# EAGLE schematic TIVA_SHIELD_Ver_2.3_AD8032_MSOP (EAGLE 9.6.2)
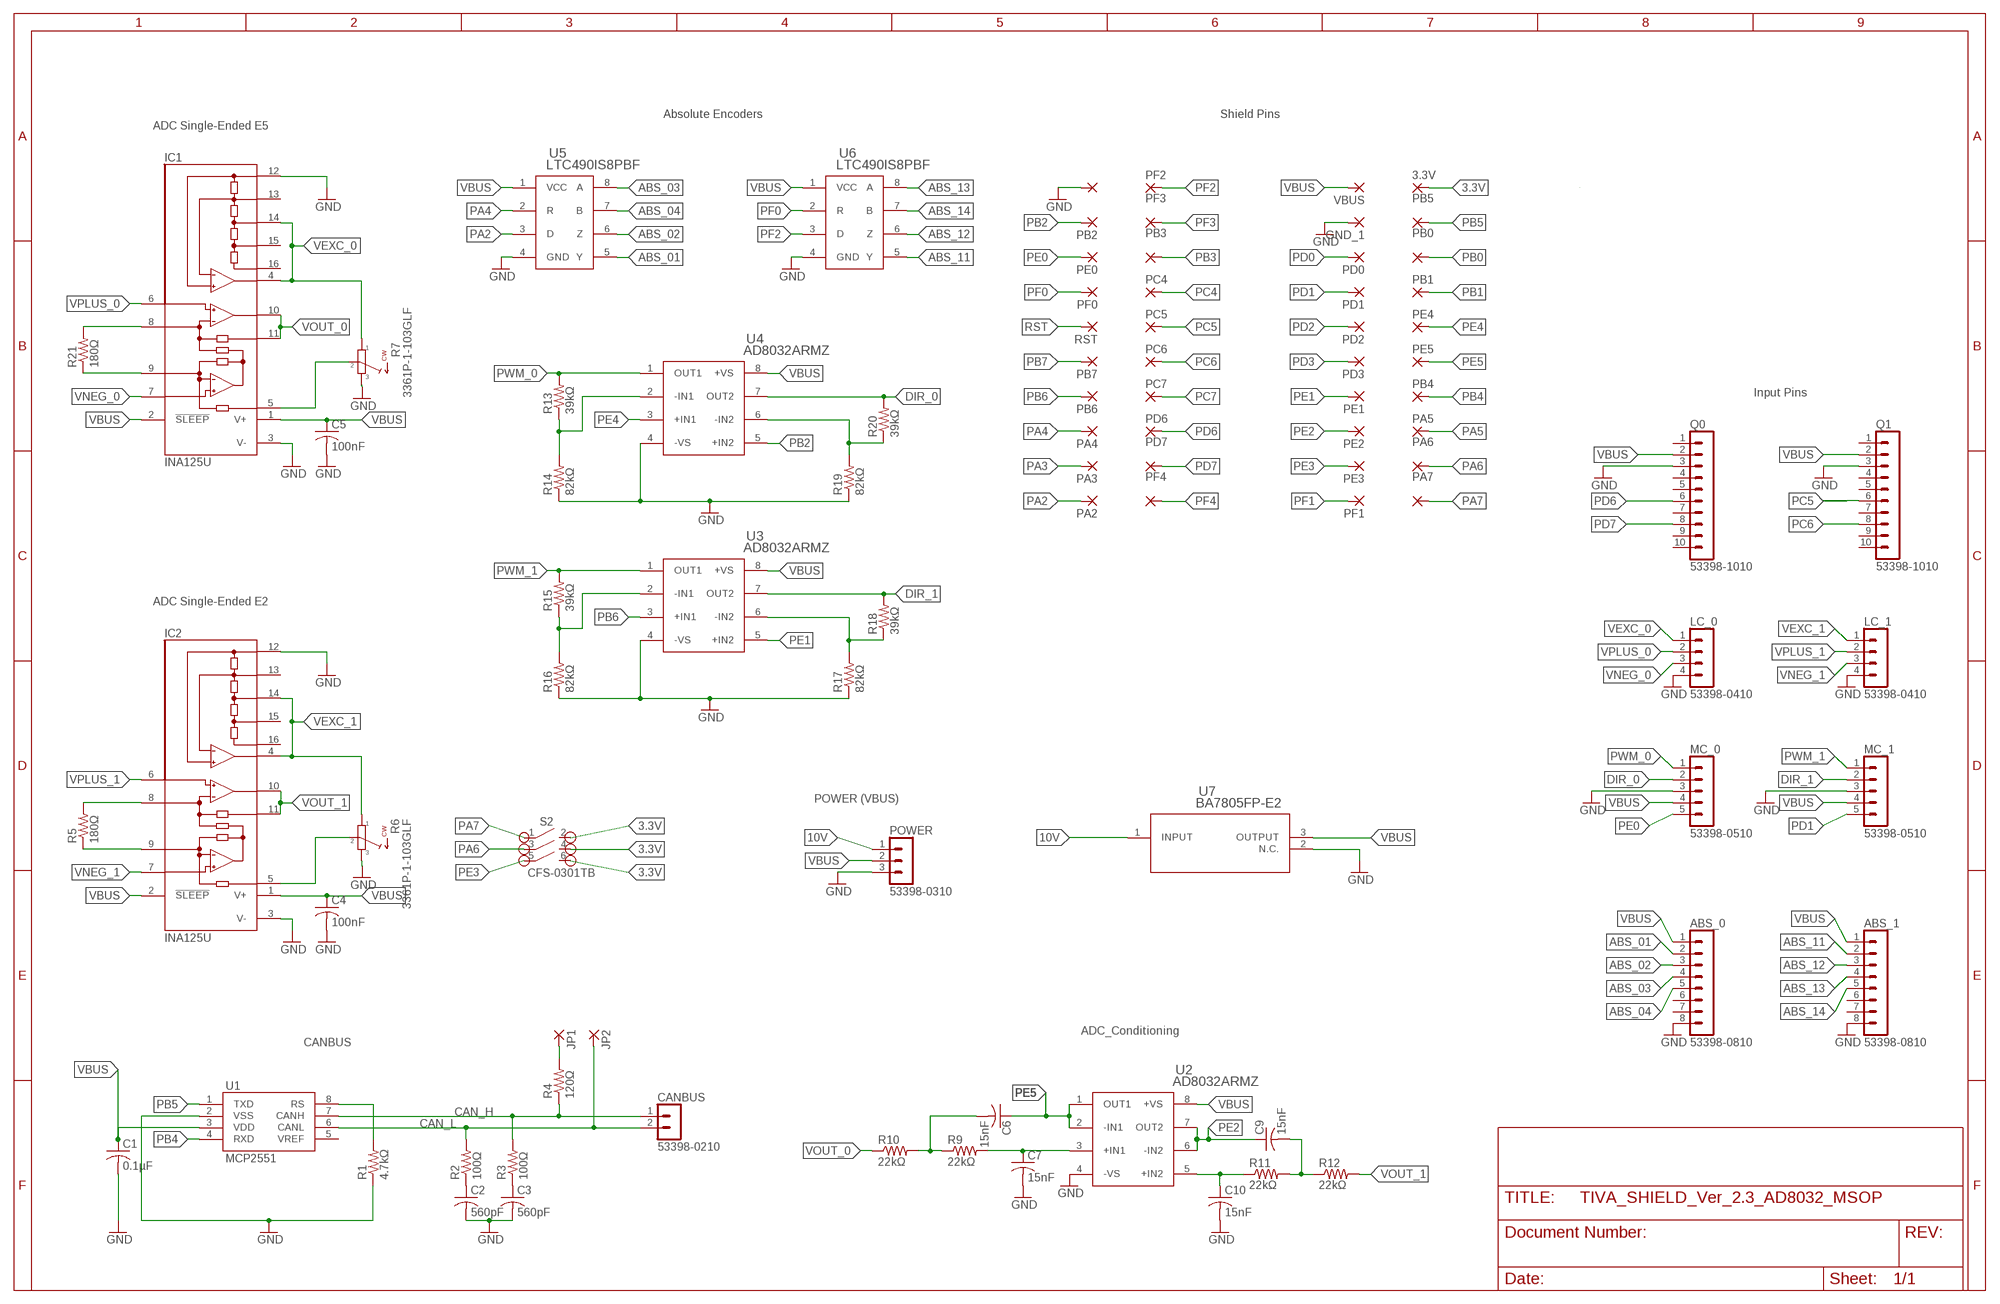
[diagram p0: schematic, sheet 1]

## Parts
3.3V  1,6/0,9  [1,6/0,9]
ABS_0  53398-0810  [53398-0810]
ABS_1  53398-0810  [53398-0810]
C1  0.1µF  C-USC0805  [C0805]
C2  560pF  C-USC0805  [C0805]
C3  560pF  C-USC0805  [C0805]
C4  100nF  C-USC0805  [C0805]
C5  100nF  C-USC0805  [C0805]
C6  15nF  C-USC0805  [C0805]
C7  15nF  C-USC0805  [C0805]
C9  15nF  C-USC0805  [C0805]
C10  15nF  C-USC0805  [C0805]
CANBUS  53398-0210  [53398-0210]
GND_0  1,6/0,9  [1,6/0,9]
GND_1  1,6/0,9  [1,6/0,9]
IC1  INA125U  [SO16-1]
IC2  INA125U  [SO16-1]
JP1  1,6/0,9  [1,6/0,9]
JP2  1,6/0,9  [1,6/0,9]
LC_0  53398-0410  [53398-0410]
LC_1  53398-0410  [53398-0410]
MC_0  53398-0510  [53398-0510]
MC_1  53398-0510  [53398-0510]
PA2  1,6/0,9  [1,6/0,9]
PA3  1,6/0,9  [1,6/0,9]
PA4  1,6/0,9  [1,6/0,9]
PA5  1,6/0,9  [1,6/0,9]
PA6  1,6/0,9  [1,6/0,9]
PA7  1,6/0,9  [1,6/0,9]
PB0  1,6/0,9  [1,6/0,9]
PB1  1,6/0,9  [1,6/0,9]
PB2  1,6/0,9  [1,6/0,9]
PB3  1,6/0,9  [1,6/0,9]
PB4  1,6/0,9  [1,6/0,9]
PB5  1,6/0,9  [1,6/0,9]
PB6  1,6/0,9  [1,6/0,9]
PB7  1,6/0,9  [1,6/0,9]
PC4  1,6/0,9  [1,6/0,9]
PC5  1,6/0,9  [1,6/0,9]
PC6  1,6/0,9  [1,6/0,9]
PC7  1,6/0,9  [1,6/0,9]
PD0  1,6/0,9  [1,6/0,9]
PD1  1,6/0,9  [1,6/0,9]
PD2  1,6/0,9  [1,6/0,9]
PD3  1,6/0,9  [1,6/0,9]
PD6  1,6/0,9  [1,6/0,9]
PD7  1,6/0,9  [1,6/0,9]
PE0  1,6/0,9  [1,6/0,9]
PE1  1,6/0,9  [1,6/0,9]
PE2  1,6/0,9  [1,6/0,9]
PE3  1,6/0,9  [1,6/0,9]
PE4  1,6/0,9  [1,6/0,9]
PE5  1,6/0,9  [1,6/0,9]
PF0  1,6/0,9  [1,6/0,9]
PF1  1,6/0,9  [1,6/0,9]
PF2  1,6/0,9  [1,6/0,9]
PF3  1,6/0,9  [1,6/0,9]
PF4  1,6/0,9  [1,6/0,9]
POWER  53398-0310  [53398-0310]
Q0  53398-1010  [53398-1010]
Q1  53398-1010  [53398-1010]
R1  4.7kΩ  R-US_R0805  [R0805]
R2  100Ω  R-US_R0805  [R0805]
R3  100Ω  R-US_R0805  [R0805]
R4  120Ω  R-US_R0805  [R0805]
R5  180Ω  R-US_R0805  [R0805]
R6  3361P-1-103GLF  3361P-1-103GLFSMD  [3361P-1-103GLF]
R7  3361P-1-103GLF  3361P-1-103GLFSMD  [3361P-1-103GLF]
R9  22kΩ  R-US_R0805  [R0805]
R10  22kΩ  R-US_R0805  [R0805]
R11  22kΩ  R-US_R0805  [R0805]
R12  22kΩ  R-US_R0805  [R0805]
R13  39kΩ  R-US_R0805  [R0805]
R14  82kΩ  R-US_R0805  [R0805]
R15  39kΩ  R-US_R0805  [R0805]
R16  82kΩ  R-US_R0805  [R0805]
R17  82kΩ  R-US_R0805  [R0805]
R18  39kΩ  R-US_R0805  [R0805]
R19  82kΩ  R-US_R0805  [R0805]
R20  39kΩ  R-US_R0805  [R0805]
R21  180Ω  R-US_R0805  [R0805]
RST  1,6/0,9  [1,6/0,9]
S2  CFS-0301TB  CFS-0301TBSMD  [CFS-0301TB]
U1  MCP2551  [SO08]
U2  AD8032ARMZ  [RM_8]
U3  AD8032ARMZ  [RM_8]
U4  AD8032ARMZ  [RM_8]
U5  LTC490IS8PBF  [SO-8_S]
U6  LTC490IS8PBF  [SO-8_S]
U7  BA7805FP-E2  [TO252-3_ROM]
VBUS  1,6/0,9  [1,6/0,9]

## Nets
3.3V: 3.3V.1(P) S2.2 S2.4 S2.6
10V: POWER.1 U7.1(INPUT)
ABS_01: ABS_0.2 U5.5(Y)
ABS_02: ABS_0.3 U5.6(Z)
ABS_03: ABS_0.4 U5.8(A)
ABS_04: ABS_0.5 U5.7(B)
ABS_11: ABS_1.2 U6.5(Y)
ABS_12: ABS_1.3 U6.6(Z)
ABS_13: ABS_1.4 U6.8(A)
ABS_14: ABS_1.5 U6.7(B)
CAN_H: CANBUS.1 R3.2 R4.1 U1.7(CANH)
CAN_L: CANBUS.2 JP2.1(P) R2.2 U1.6(CANL)
DIR_0: MC_0.2 R20.2 U4.7(OUT2)
DIR_1: MC_1.2 R18.2 U3.7(OUT2)
GND: ABS_0.8 ABS_1.8 C1.2 C2.2 C3.2 C4.2 C5.2 C7.2 C10.2 GND_0.1(P) GND_1.1(P) IC1.3(V-) IC1.12(REFCOM) IC2.3(V-) IC2.12(REFCOM) LC_0.4 LC_1.4 MC_0.3 MC_1.3 POWER.3 Q0.3 Q1.3 R1.1 R6.3 R7.3 R14.1 R16.1 R17.1 R19.1 U1.2(VSS) U2.4(-VS) U3.4(-VS) U4.4(-VS) U5.4(GND) U6.4(GND) U7.2(N.C.)
N$1: R1.2 U1.8(RS)
N$4: C2.1 R2.1
N$5: C3.1 R3.1
N$6: JP1.1(P) R4.2
N$7: IC2.9(RG) R5.1
N$8: IC2.8(RG) R5.2
N$9: IC2.5(REF) R6.2
N$10: IC1.9(RG) R21.1
N$11: IC1.8(RG) R21.2
N$12: IC1.5(REF) R7.2
N$13: C10.1 R11.1 U2.5(+IN2)
N$14: C9.2 R11.2 R12.1
N$15: C7.1 R9.2 U2.3(+IN1)
N$16: R19.2 R20.1 U4.6(-IN2)
N$17: R17.2 R18.1 U3.6(-IN2)
N$18: C6.2 R9.1 R10.2
N$19: R13.1 R14.2 U4.2(-IN1)
N$20: R15.1 R16.2 U3.2(-IN1)
PA2: PA2.1(P) U5.3(D)
PA3: PA3.1(P)
PA4: PA4.1(P) U5.2(R)
PA5: PA5.1(P)
PA6: PA6.1(P) S2.3
PA7: PA7.1(P) S2.1
PB0: PB0.1(P)
PB1: PB1.1(P)
PB2: PB2.1(P) U4.5(+IN2)
PB3: PB3.1(P)
PB4: PB4.1(P) U1.4(RXD)
PB5: PB5.1(P) U1.1(TXD)
PB6: PB6.1(P) U3.3(+IN1)
PB7: PB7.1(P)
PC4: PC4.1(P)
PC5: PC5.1(P) Q1.6
PC6: PC6.1(P) Q1.8
PC7: PC7.1(P)
PD0: PD0.1(P)
PD1: MC_1.5 PD1.1(P)
PD2: PD2.1(P)
PD3: PD3.1(P)
PD6: PD6.1(P) Q0.6
PD7: PD7.1(P) Q0.8
PE0: MC_0.5 PE0.1(P)
PE1: PE1.1(P) U3.5(+IN2)
PE2: C9.1 PE2.1(P) U2.6(-IN2) U2.7(OUT2)
PE3: PE3.1(P) S2.5
PE4: PE4.1(P) U4.3(+IN1)
PE5: C6.1 PE5.1(P) U2.1(OUT1) U2.2(-IN1)
PF0: PF0.1(P) U6.2(R)
PF1: PF1.1(P)
PF2: PF2.1(P) U6.3(D)
PF3: PF3.1(P)
PF4: PF4.1(P)
PWM_0: MC_0.1 R13.2 U4.1(OUT1)
PWM_1: MC_1.1 R15.2 U3.1(OUT1)
RST: RST.1(P)
VBUS: ABS_0.1 ABS_1.1 C1.1 C4.1 C5.1 IC1.1(V+) IC1.2(!SLEEP) IC2.1(V+) IC2.2(!SLEEP) MC_0.4 MC_1.4 POWER.2 Q0.2 Q1.2 U1.3(VDD) U2.8(+VS) U3.8(+VS) U4.8(+VS) U5.1(VCC) U6.1(VCC) U7.3(OUTPUT) VBUS.1(P)
VEXC_0: IC1.4(REFOUT) IC1.14(REF2.5) LC_0.1 R7.1
VEXC_1: IC2.4(REFOUT) IC2.14(REF2.5) LC_1.1 R6.1
VNEG_0: IC1.7(-IN) LC_0.3
VNEG_1: IC2.7(-IN) LC_1.3
VOUT_0: IC1.10(OUT) IC1.11(SENSE) R10.1
VOUT_1: IC2.10(OUT) IC2.11(SENSE) R12.2
VPLUS_0: IC1.6(+IN) LC_0.2
VPLUS_1: IC2.6(+IN) LC_1.2
Unconnected: ABS_0.6 ABS_0.7 ABS_1.6 ABS_1.7 IC1.13(REFBG) IC1.15(REF5) IC1.16(REF10) IC2.13(REFBG) IC2.15(REF5) IC2.16(REF10) Q0.1 Q0.4 Q0.5 Q0.7 Q0.9 Q0.10 Q1.1 Q1.4 Q1.5 Q1.7 Q1.9 Q1.10 U1.5(VREF)

## Notes on the sheet
- Absolute Encoders | Shield Pins
- ADC Single-Ended E5
- Input Pins
- ADC Single-Ended E2
- POWER (VBUS)
- ADC_Conditioning
- CANBUS

## Library data of the parts
3.3V GND_0 GND_1 JP1 JP2 PA2-PA7 PB0 PB1-PB7 PC4-PC7 PD0 PD1-PD3 PD6 PD7 PE0 PE1-PE5 PF0 PF1-PF4 RST VBUS = wirepad:1,6/0,9: THROUGH-HOLE PAD
ABS_0 ABS_1 = con-molex-picoblade:53398-0810: HEADER
C1-C7 C9 C10 = rcl:C-US: CAPACITOR, American symbol; SPICEPREFIX: C
CANBUS = con-molex-picoblade:53398-0210: HEADER
IC1 IC2 = burr-brown_1:INA125: Instrumentation Amplifier with Precision Voltage Reference; MF: TEXAS INSTRUMENT CONNECTORS; MPN: INA125U; OC_FARNELL: 1304375; OC_NEWARK: 80K5901
LC_0 LC_1 = con-molex-picoblade:53398-0410: HEADER
MC_0 MC_1 = con-molex-picoblade:53398-0510: HEADER
POWER = con-molex-picoblade:53398-0310: HEADER
Q0 Q1 = con-molex-picoblade:53398-1010: HEADER
R1-R5 R9-R21 = rcl:R-US_: RESISTOR, American symbol; SPICEPREFIX: R
R6 R7 = TREC_Library:3361P-1-103GLF: Bourns Surface Mount Trimmer Potentiometer
S2 = TREC_Library:CFS-0301TB: CFS Slide Switches 3 Position Slide Switch CFS-0301TB CFS = Series Name 03 = Number of bits 01 = Flat Knob non washable type T = Packing = Taping B = Gull Wing CFS DATASHEET <https://www.nidec-copal-electronics.com/e/catalog/switch/cfs.pdf>
U1 = SparkFun-IC-Comms:MCP2551: MCP2551 High Speed CAN Transceiver High speed CAN transceiver Datasheet <http://www.sparkfun.com/datasheets/DevTools/Arduino/MCP2551.pdf> SparkFun Products CAN-BUS Shield <https://www.sparkfun.com/products/13262> (DEV-13262) SparkFun OBD-II UART <https://www.sparkfun.com/products/9555> (WIG-09555); PROD_ID: IC-09907
U2-U4 = AD8032ARMZ:AD8032ARMZ; MANUFACTURER_PART_NUMBER: AD8032ARMZ; VENDOR: Analog Devices Inc
U5 U6 = LTC490:LTC490IS8PBF; MANUFACTURER_PART_NUMBER: LTC490IS8#PBF; VENDOR: Linear Technology
U7 = Rohm_Semiconductors:BA7805FP-E2; COPYRIGHT: Copyright (C) 2021 Ultra Librarian. All rights reserved.; MANUFACTURER_PART_NUMBER: BA7805FP-E2; MFR_NAME: ROHM Semiconductor